# EAGLE design RNS_Board (EAGLE 9.5.1)
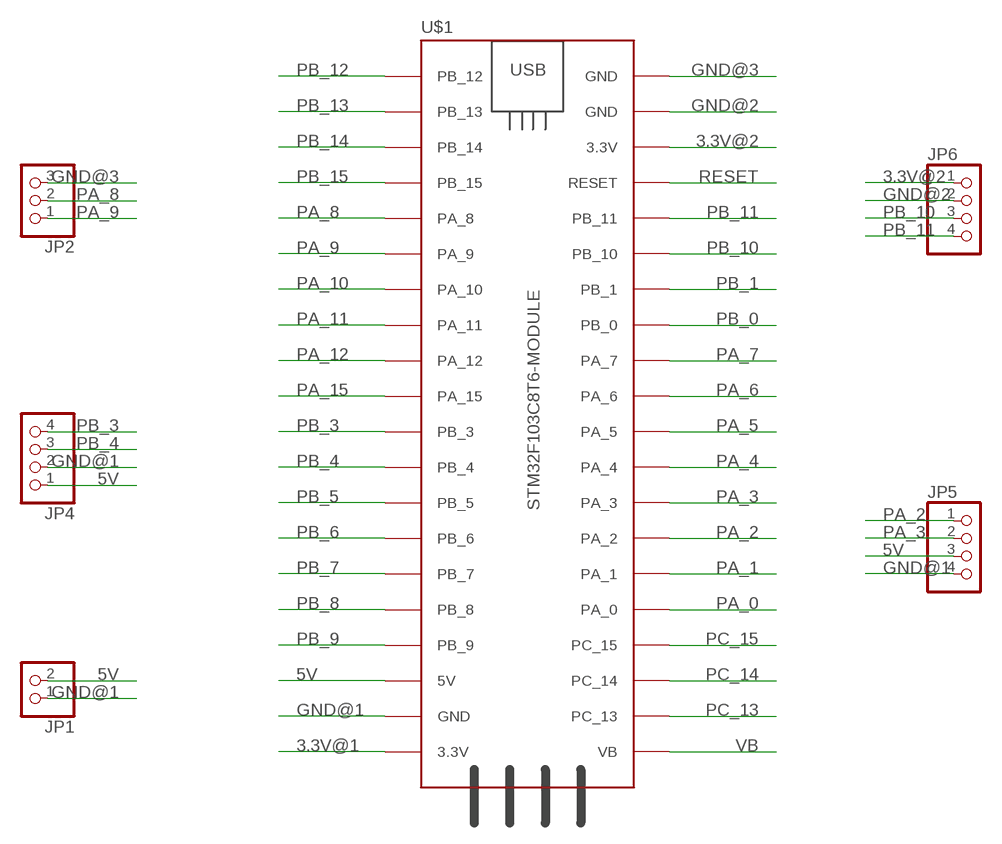
[diagram p0: schematic, sheet 1]

## Parts
JP1  PINHD-1X2  [1X02]
JP2  PINHD-1X3  [1X03]
JP4  PINHD-1X4  [1X04]
JP5  PINHD-1X4  [1X04]
JP6  PINHD-1X4  [1X04]
U$1  STM32F103C8T6-MODULE  [STM32F103C8T6-MODULE]

## Nets
3.3V@1: U$1.3.3V_1(3.3V)
3.3V@2: JP6.1 U$1.3.3V_2(3.3V)
5V: JP1.2 JP4.1 JP5.3 U$1.5V
GND@1: JP1.1 JP4.2 JP5.4 U$1.GND_1(GND)
GND@2: JP6.2 U$1.GND_2(GND)
GND@3: JP2.3 U$1.GND_3(GND)
PA_0: U$1.PA_0
PA_1: U$1.PA_1
PA_2: JP5.1 U$1.PA_2
PA_3: JP5.2 U$1.PA_3
PA_4: U$1.PA_4
PA_5: U$1.PA_5
PA_6: U$1.PA_6
PA_7: U$1.PA_7
PA_8: JP2.2 U$1.PA_8
PA_9: JP2.1 U$1.PA_9
PA_10: U$1.PA_10
PA_11: U$1.PA_11
PA_12: U$1.PA_12
PA_15: U$1.PA_15
PB_0: U$1.PB_0
PB_1: U$1.PB_1
PB_3: JP4.4 U$1.PB_3
PB_4: JP4.3 U$1.PB_4
PB_5: U$1.PB_5
PB_6: U$1.PB_6
PB_7: U$1.PB_7
PB_8: U$1.PB_8
PB_9: U$1.PB_9
PB_10: JP6.3 U$1.PB_10
PB_11: JP6.4 U$1.PB_11
PB_12: U$1.PB_12
PB_13: U$1.PB_13
PB_14: U$1.PB_14
PB_15: U$1.PB_15
PC_13: U$1.PC_13
PC_14: U$1.PC_14
PC_15: U$1.PC_15
RESET: U$1.RESET
VB: U$1.VB

## Library data of the parts
JP1 = MIA_LIBRARY-2-2-2:PINHD-1X2: PIN HEADER
JP2 = MIA_LIBRARY-2-2-2:PINHD-1X3: PIN HEADER
JP4-JP6 = MIA_LIBRARY-2-2-2:PINHD-1X4: PIN HEADER
U$1 = MIA_LIBRARY-2-2-2:STM32F103C8T6-MODULE: STM32F103C8T6 module with ARM Cortex-3, 20kB SRAM, 64kB Flash, 72MHz

## Board
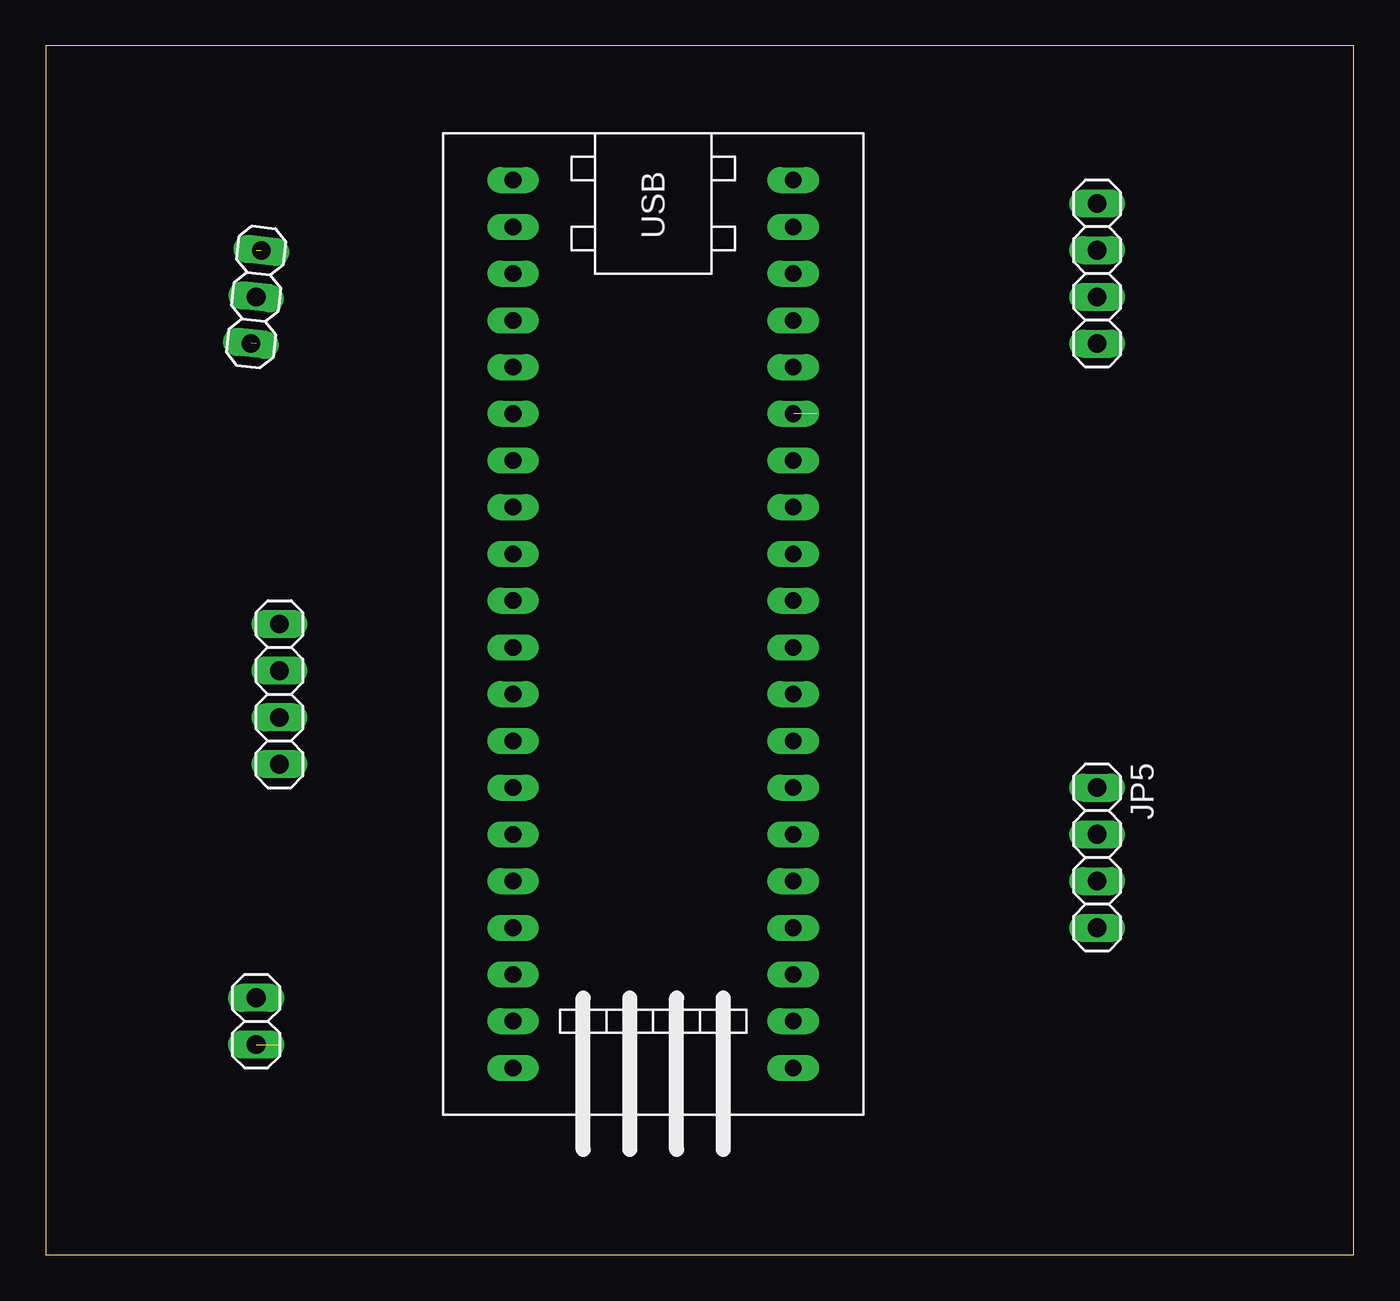
[diagram p1: board, top side]
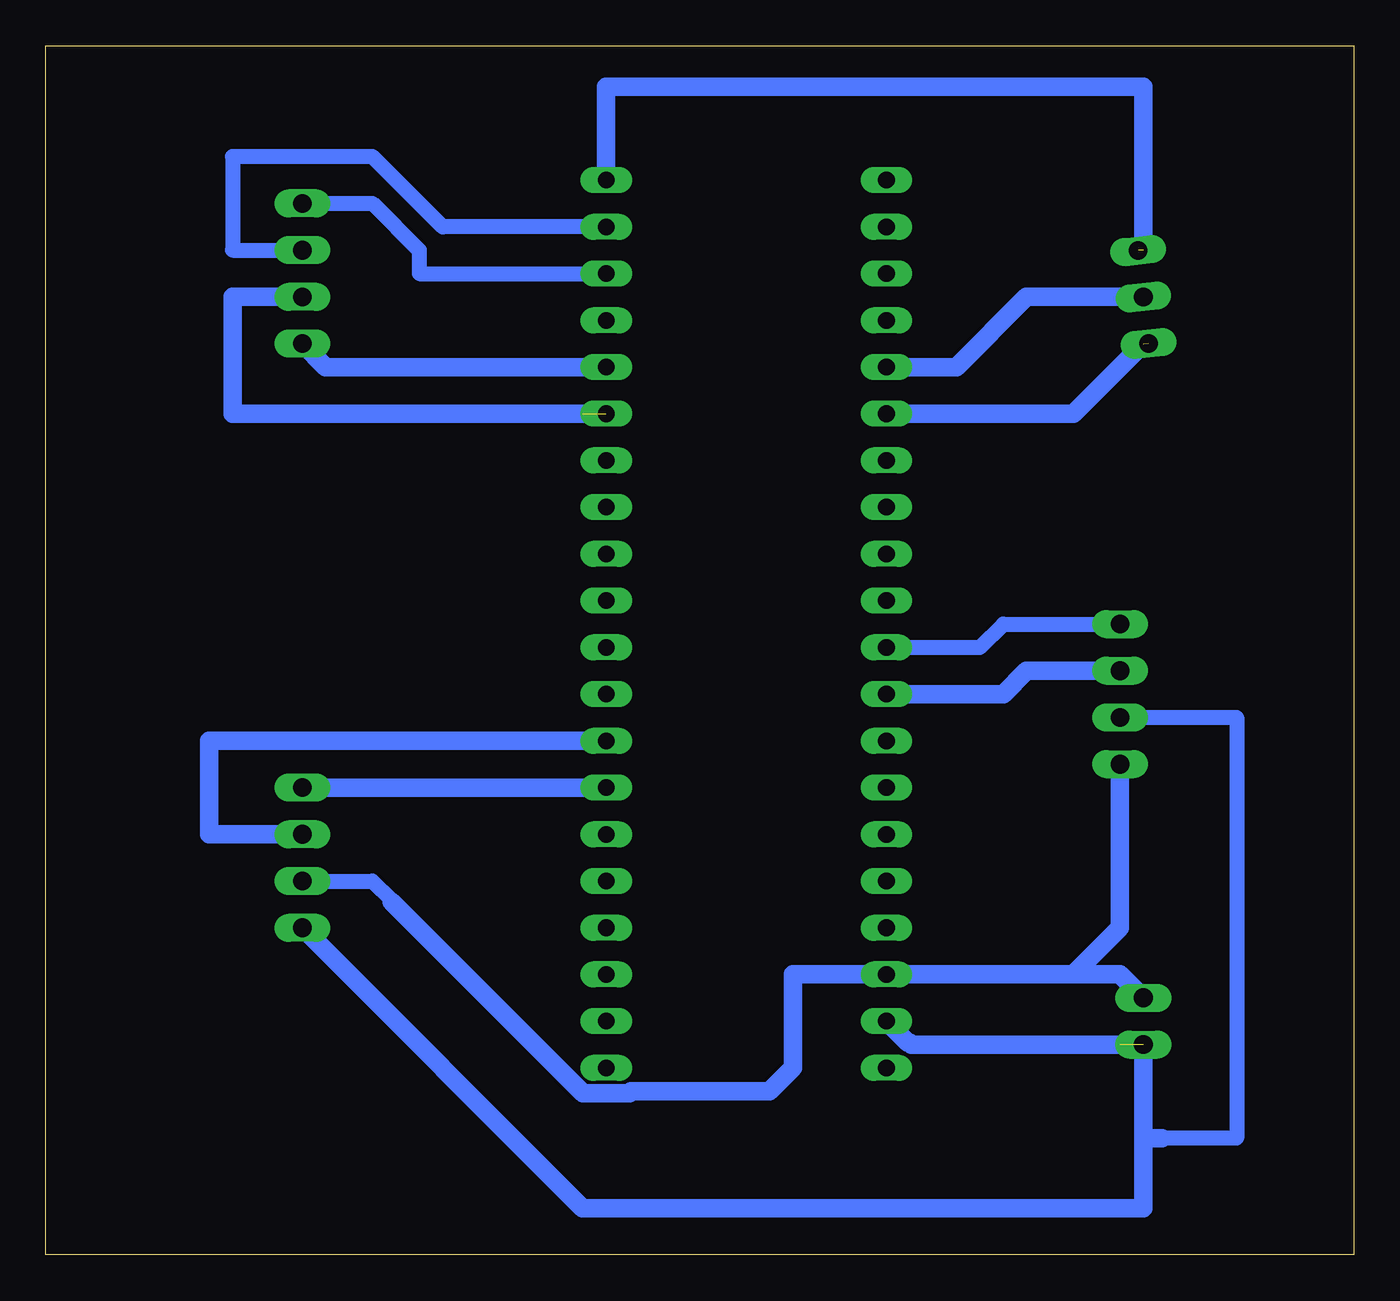
[diagram p2: board, bottom side, seen from below]

Size 71.1 x 65.71 mm. Coordinates in mm from the lower left corner, seen from the top.
Outline: 0,0 71.1,0 71.1,65.71 0,65.71 0,0
Copper layers (1*16): Top 0.035mm / dielectric 1.5mm / Bottom 0.035mm
Design rules "default": minimum track width 6mil, minimum drill 0.35mm, track to track 6mil, track to pad 6mil, pad to pad 6mil, via to via 6mil, smd to smd 6mil, copper to edge 40mil, drill to drill 6mil, minimum pad ring 10mil, minimum via ring 8mil, stop-mask expansion 4mil, vias tented up to drill 0mil, thermal gap 10mil

### Footprints (pad centres in the part's own frame; a part is rotated, then mirrored left to right if it is on the bottom)
1X02 = drill 1.016 long: 1 -1.27,0; 2 1.27,0
1X03 = drill 1.016 long: 1 -2.54,0; 2 0,0; 3 2.54,0
1X04 = drill 1.016 long: 1 -3.81,0; 2 -1.27,0; 3 1.27,0; 4 3.81,0
STM32F103C8T6-MODULE = drill 0.9 long: 3.3V_1 25.4,-7.62; 3.3V_2 -17.78,7.62; 5V 20.32,-7.62; GND_1 22.86,-7.62; GND_2 -20.32,7.62; GND_3 -22.86,7.62; PA_0 15.24,7.62; PA_1 12.7,7.62; PA_2 10.16,7.62; PA_3 7.62,7.62; PA_4 5.08,7.62; PA_5 2.54,7.62; PA_6 0,7.62; PA_7 -2.54,7.62; PA_8 -12.7,-7.62; PA_9 -10.16,-7.62; PA_10 -7.62,-7.62; PA_11 -5.08,-7.62; PA_12 -2.54,-7.62; PA_15 0,-7.62; PB_0 -5.08,7.62; PB_1 -7.62,7.62; PB_3 2.54,-7.62; PB_4 5.08,-7.62; PB_5 7.62,-7.62; PB_6 10.16,-7.62; PB_7 12.7,-7.62; PB_8 15.24,-7.62; PB_9 17.78,-7.62; PB_10 -10.16,7.62; PB_11 -12.7,7.62; PB_12 -22.86,-7.62; PB_13 -20.32,-7.62; PB_14 -17.78,-7.62; PB_15 -15.24,-7.62; PC_13 22.86,7.62; PC_14 20.32,7.62; PC_15 17.78,7.62; RESET -15.24,7.62; VB 25.4,7.62

### Placement (x,y rotation side)
JP1  11.43,12.7 90 top
JP2  11.43,52.07 83.7 top
JP4  12.7,30.48 90 top
JP5  57.15,21.59 270 top
JP6  57.15,53.34 270 top
U$1  33.02,35.56 270 top

### Tracks (layer width: path | path; a pad name or v marks a point on that pad's centre or on a via)
3.3V@2
  Bottom 0.813: JP6.1 53.34,57.15 50.8,54.61 50.8,53.34 U$1.3.3V_2
5V
  Bottom 0.813: JP5.3 53.34,20.32 52.32,19.3 52.32,19.2
  Bottom 1.016: 15.24,15.24 U$1.5V 30.48,15.24 30.48,10.16 31.75,8.89 39.28,8.89 39.37,8.8 41.91,8.8 52.32,19.2 | 15.24,15.24 12.7,15.24 JP1.2 | JP4.1 12.7,17.78 15.24,15.24
GND@1  (1 unrouted)
  Bottom 0.813: JP4.2 6.35,29.21 6.35,6.35 10.41,6.35
  Bottom 1.016: U$1.GND_1 24.22,11.52 24.13,11.52 24.04,11.43 12.7,11.43 | JP1.1 11.43,6.35 | 10.41,6.35 11.43,6.35 | JP5.4 41.91,2.54 11.43,2.54 11.43,6.35
GND@2
  Bottom 0.813: U$1.GND_2 49.53,55.88 53.34,59.69 60.96,59.69 60.96,54.61 JP6.2
GND@3  (1 unrouted)
  Bottom 1.016: U$1.GND_3 40.64,63.5 11.43,63.5 11.43,54.61
PA_2
  Bottom 1.016: JP5.1 U$1.PA_2
PA_3
  Bottom 1.016: JP5.2 62.23,22.86 62.23,27.94 U$1.PA_3
PA_8
  Bottom 1.016: U$1.PA_8 21.59,48.26 17.78,52.07 JP2.2
PA_9  (1 unrouted)
  Bottom 1.016: U$1.PA_9 15.24,45.72 11.43,49.53
PB_3
  Bottom 0.813: U$1.PB_3 20.32,33.02 19.05,34.29 JP4.4
PB_4
  Bottom 1.016: U$1.PB_4 19.05,30.48 17.78,31.75 JP4.3
PB_10  (1 unrouted)
  Bottom 1.016: JP6.3 60.96,52.07 60.96,45.72 41.91,45.72
PB_11
  Bottom 1.016: JP6.4 55.88,48.26 U$1.PB_11